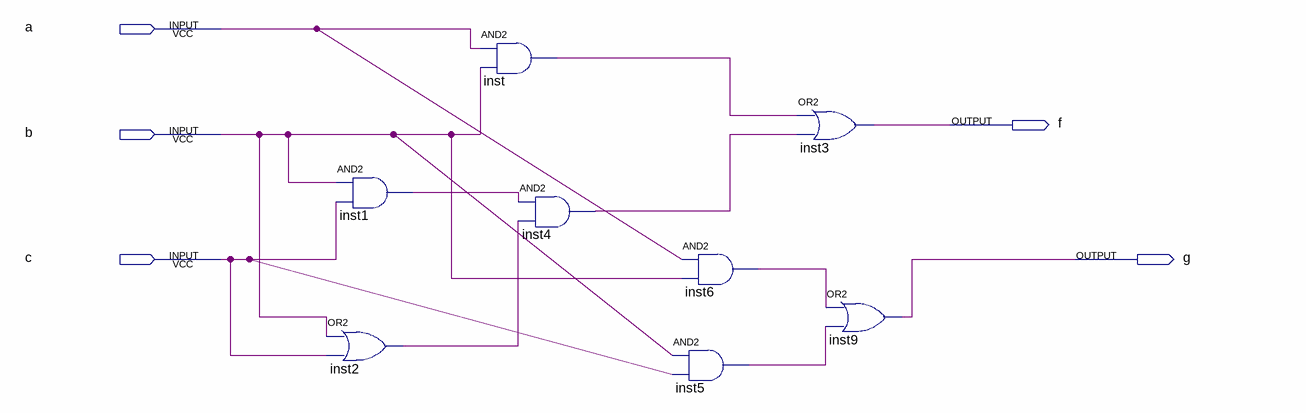
[diagram p0: schematic sheet]
// Quartus schematic AULA2.bdf as structural Verilog: 8 symbols, 5 pins
module AULA2 (
  input  a,
  input  b,
  input  c,
  output f,
  output g
);

  wire inst1_out, inst2_out, inst4_out, inst5_out, inst6_out, inst_out;

  and inst1 (inst1_out, b, c);
  or inst2 (inst2_out, b, c);
  and inst (inst_out, a, b);
  and inst4 (inst4_out, inst1_out, inst2_out);
  and inst6 (inst6_out, a, b);
  and inst5 (inst5_out, b, c);
  or inst3 (f, inst_out, inst4_out);
  or inst9 (g, inst6_out, inst5_out);
endmodule
